# Altium schematic sheet PCB_3U_BNC.schdoc: Title
size 420 x 297 mm; Author: G.K.; CompanyName: WUT; DrawnBy: G.K.; Organization: CERN; Address1: Warsaw Univeristy of Technology; Address2: Nowowiejska 15/19; Revision: -; SheetNumber: -; SheetTotal: -; EDA_Number: ARTIQ; Projet: ADC/DAC MEZZANINE; ModifiedBy: -; CreateDate: XX/XX/XXXX; CheckedDate: -; Title2: Title2; DivGrp: ISE; Designer: G.K.; ModifiedDate: -; ProjectName: ADC/DAC MEZZANINE
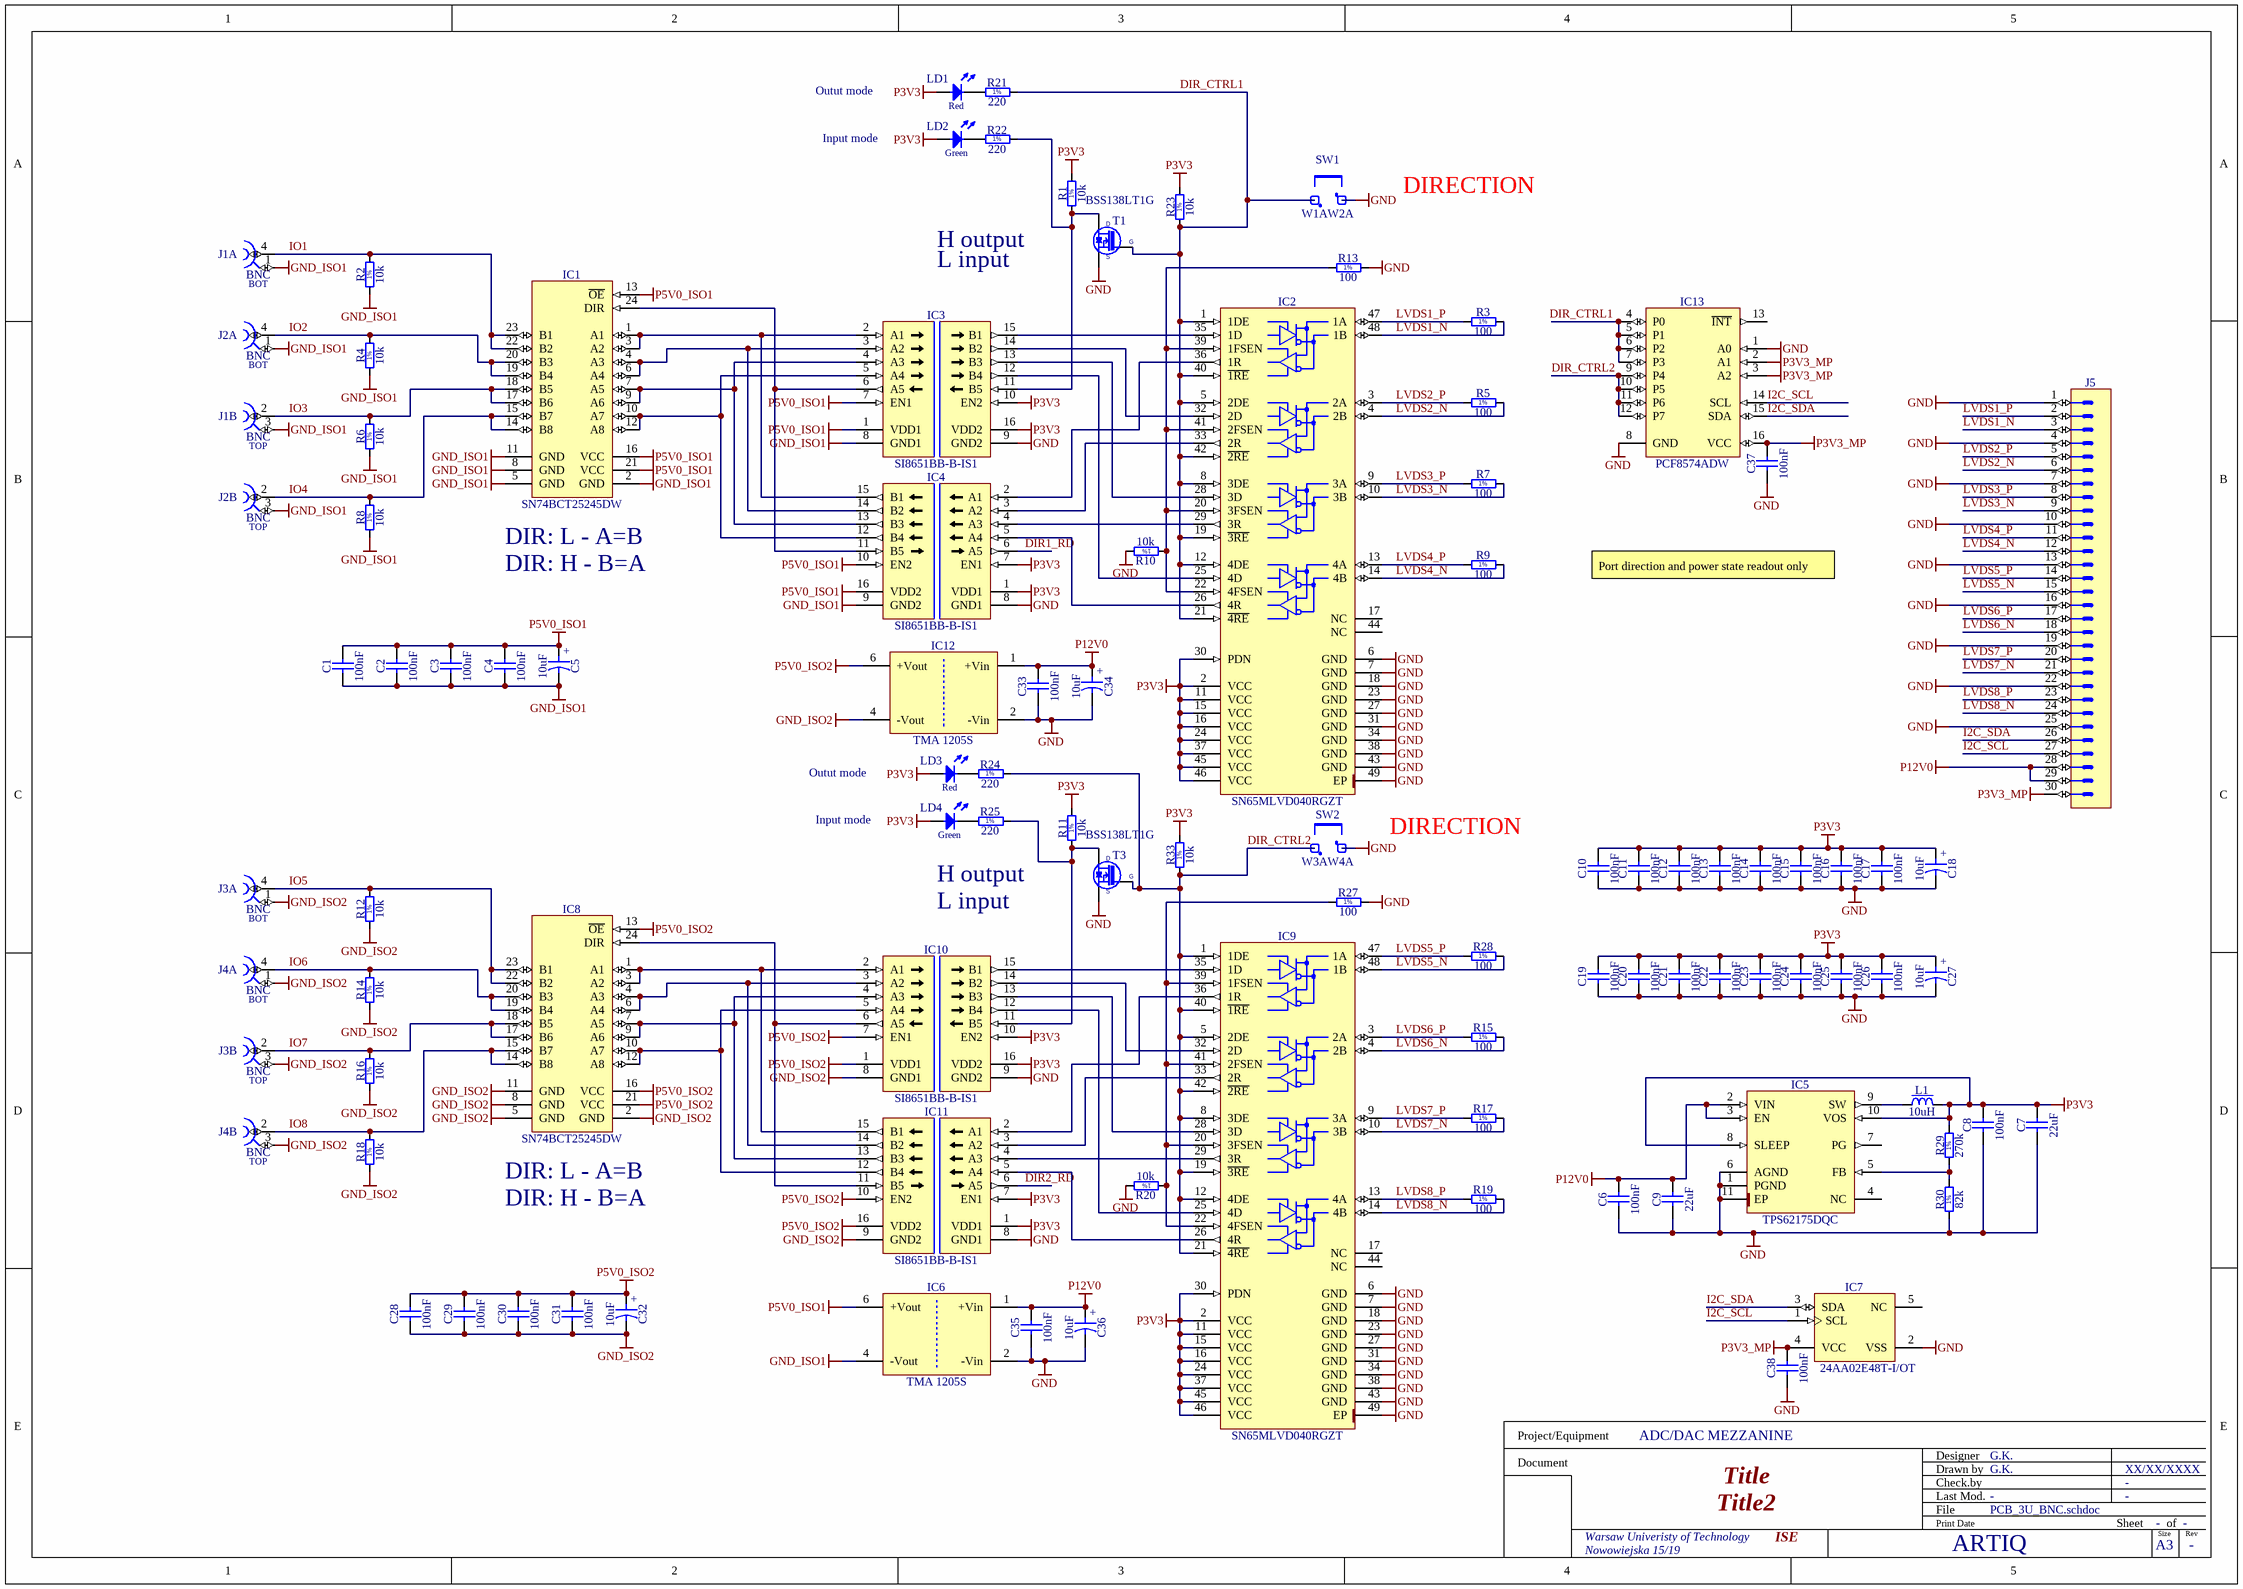
[diagram p0: PCB_3U_BNC.schdoc]

## Parts
C1  100nF  [CAPC1005X55N]
C2  100nF  [CAPC1005X55N]
C3  100nF  [CAPC1005X55N]
C4  100nF  [CAPC1005X55N]
C5  10uF  [CAPAE430X540N]
C6  100nF  [CAPC1005X55N]
C7  22uF  [CAPC2012X135N]
C8  100nF  [CAPC1005X55N]
C9  22uF  [CAPC2012X135N]
C10  100nF  [CAPC1005X55N]
C11  100nF  [CAPC1005X55N]
C12  100nF  [CAPC1005X55N]
C13  100nF  [CAPC1005X55N]
C14  100nF  [CAPC1005X55N]
C15  100nF  [CAPC1005X55N]
C16  100nF  [CAPC1005X55N]
C17  100nF  [CAPC1005X55N]
C18  10uF  [CAPAE430X540N]
C19  100nF  [CAPC1005X55N]
C20  100nF  [CAPC1005X55N]
C21  100nF  [CAPC1005X55N]
C22  100nF  [CAPC1005X55N]
C23  100nF  [CAPC1005X55N]
C24  100nF  [CAPC1005X55N]
C25  100nF  [CAPC1005X55N]
C26  100nF  [CAPC1005X55N]
C27  10uF  [CAPAE430X540N]
C28  100nF  [CAPC1005X55N]
C29  100nF  [CAPC1005X55N]
C30  100nF  [CAPC1005X55N]
C31  100nF  [CAPC1005X55N]
C32  10uF  [CAPAE430X540N]
C33  100nF  [CAPC1005X55N]
C34  10uF  [CAPAE430X540N]
C35  100nF  [CAPC1005X55N]
C36  10uF  [CAPAE430X540N]
C37  100nF  [CAPC1005X55N]
C38  100nF  [CAPC1005X55N]
IC1  SN74BCT25245DW  [SOIC127P1030X265-24N]
IC2  SN65MLVD040RGZT  [QFN50P700X700X100-49N-S420]
IC3  SI8651BB-B-IS1  [SOIC127P600X175-16N]
IC4  SI8651BB-B-IS1  [SOIC127P600X175-16N]
IC5  TPS62175DQC  [SON50P200X300X80-11N-R94X250]
IC6  TMA 1205S  [DCDC_TRACO_TMA]
IC7  24AA02E48T-I/OT  [SOT95P280X145-5N]
IC8  SN74BCT25245DW  [SOIC127P1030X265-24N]
IC9  SN65MLVD040RGZT  [QFN50P700X700X100-49N-S420]
IC10  SI8651BB-B-IS1  [SOIC127P600X175-16N]
IC11  SI8651BB-B-IS1  [SOIC127P600X175-16N]
IC12  TMA 1205S  [DCDC_TRACO_TMA]
IC13  PCF8574ADW  [SOIC127P1030X265-16N]
J1  BNC  [BOMAR_364A2595]  (parts A,B of 2)
J2  BNC  [BOMAR_364A2595]  (parts A,B of 2)
J3  BNC  [BOMAR_364A2595]  (parts A,B of 2)
J4  BNC  [BOMAR_364A2595]  (parts A,B of 2)
J5  (no value)  [3M_N2530-6002RB]
L1  10uH  [IND_MURATA-PS_8400]
LD1  Red  [LED_AVAGO_HSMC-C120]  (value not drawn)
LD2  Green  [LED_AVAGO_HSME-C120]  (value not drawn)
LD3  Red  [LED_AVAGO_HSMC-C120]  (value not drawn)
LD4  Green  [LED_AVAGO_HSME-C120]  (value not drawn)
R1  10k  [RESC1005X40N]
R2  10k  [RESC1005X40N]
R3  100  [RESC1005X40N]
R4  10k  [RESC1005X40N]
R5  100  [RESC1005X40N]
R6  10k  [RESC1005X40N]
R7  100  [RESC1005X40N]
R8  10k  [RESC1005X40N]
R9  100  [RESC1005X40N]
R10  10k  [RESC1005X40N]
R11  10k  [RESC1005X40N]
R12  10k  [RESC1005X40N]
R13  100  [RESC1005X40N]
R14  10k  [RESC1005X40N]
R15  100  [RESC1005X40N]
R16  10k  [RESC1005X40N]
R17  100  [RESC1005X40N]
R18  10k  [RESC1005X40N]
R19  100  [RESC1005X40N]
R20  10k  [RESC1005X40N]
R21  220  [RESC1608X55N]
R22  220  [RESC1608X55N]
R23  10k  [RESC1005X40N]
R24  220  [RESC1608X55N]
R25  220  [RESC1608X55N]
R27  100  [RESC1005X40N]
R28  100  [RESC1005X40N]
R29  270k  [RESC1608X55N]
R30  82k  [RESC1608X55N]
R33  10k  [RESC1005X40N]
SW1  Jumper Type1  [JUMPER_BLACK_INSULATED_2.54MM]  (value not drawn)
SW2  Jumper Type1  [JUMPER_BLACK_INSULATED_2.54MM]  (value not drawn)
T1  BSS138LT1G  [SOT95P240X110-3N]
T3  BSS138LT1G  [SOT95P240X110-3N]
W1  Test Point  [COMATEL_385.0358.1.02.400]  (value not drawn)  (part A of 2)
W2  Test Point  [COMATEL_385.0358.1.02.400]  (value not drawn)  (part A of 2)
W3  Test Point  [COMATEL_385.0358.1.02.400]  (value not drawn)  (part A of 2)
W4  Test Point  [COMATEL_385.0358.1.02.400]  (value not drawn)  (part A of 2)

## Nets
GND: C6.1 C7.1 C8.1 C9.1 C10.1 C11.1 C12.1 C13.1 C14.1 C15.1 C16.1 C17.1 C18.2 C19.1 C20.1 C21.1 C22.1 C23.1 C24.1 C25.1 C26.1 C27.2 C33.1 C34.2 C35.1 C36.2 C37.1 C38.1 IC2.6(GND) IC2.7(GND) IC2.18(GND) IC2.23(GND) IC2.27(GND) IC2.31(GND) IC2.34(GND) IC2.38(GND) IC2.43(GND) IC2.49(EP) IC3.9(GND2) IC4.8(GND1) IC5.1(PGND) IC5.6(AGND) IC5.11(EP) IC6.2(-Vin) IC7.2(VSS) IC9.6(GND) IC9.7(GND) IC9.18(GND) IC9.23(GND) IC9.27(GND) IC9.31(GND) IC9.34(GND) IC9.38(GND) IC9.43(GND) IC9.49(EP) IC10.9(GND2) IC11.8(GND1) IC12.2(-Vin) IC13.1(A0) IC13.8(GND) J5.1 J5.4 J5.7 J5.10 J5.13 J5.16 J5.19 J5.22 J5.25 R10.2 R13.2 R20.2 R27.2 R30.1 T1.2(S) T3.2(S) W2.1 W4.1
GND_ISO1: C1.1 C2.1 C3.1 C4.1 C5.2 IC1.2(GND) IC1.5(GND) IC1.8(GND) IC1.11(GND) IC3.8(GND1) IC4.9(GND2) IC6.4(-Vout) J1.1 J1.3 J2.1 J2.3 R2.1 R4.1 R6.1 R8.1
GND_ISO2: C28.1 C29.1 C30.1 C31.1 C32.2 IC8.2(GND) IC8.5(GND) IC8.8(GND) IC8.11(GND) IC10.8(GND1) IC11.9(GND2) IC12.4(-Vout) J3.1 J3.3 J4.1 J4.3 R12.1 R14.1 R16.1 R18.1
P3V3: C7.2 C8.2 C10.2 C11.2 C12.2 C13.2 C14.2 C15.2 C16.2 C17.2 C18.1 C19.2 C20.2 C21.2 C22.2 C23.2 C24.2 C25.2 C26.2 C27.1 IC2.2(VCC) IC2.11(VCC) IC2.15(VCC) IC2.16(VCC) IC2.24(VCC) IC2.30(PDN) IC2.37(VCC) IC2.45(VCC) IC2.46(VCC) IC3.10(EN2) IC3.16(VDD2) IC4.1(VDD1) IC4.7(EN1) IC5.8(SLEEP) IC5.10(VOS) IC9.2(VCC) IC9.11(VCC) IC9.15(VCC) IC9.16(VCC) IC9.24(VCC) IC9.30(PDN) IC9.37(VCC) IC9.45(VCC) IC9.46(VCC) IC10.10(EN2) IC10.16(VDD2) IC11.1(VDD1) IC11.7(EN1) L1.2 LD1.2(A) LD2.2(A) LD3.2(A) LD4.2(A) R1.2 R11.2 R23.2 R29.2 R33.2
P3V3_MP: C37.2 C38.2 IC7.4(VCC) IC13.2(A1) IC13.3(A2) IC13.16(VCC) J5.30
P5V0_ISO1: C1.2 C2.2 C3.2 C4.2 C5.1 IC1.13(~{OE}) IC1.16(VCC) IC1.21(VCC) IC3.1(VDD1) IC3.7(EN1) IC4.10(EN2) IC4.16(VDD2) IC6.6(+Vout)
P5V0_ISO2: C28.2 C29.2 C30.2 C31.2 C32.1 IC8.13(~{OE}) IC8.16(VCC) IC8.21(VCC) IC10.1(VDD1) IC10.7(EN1) IC11.10(EN2) IC11.16(VDD2) IC12.6(+Vout)
P12V0: C6.2 C9.2 C33.2 C34.1 C35.2 C36.1 IC5.2(VIN) IC5.3(EN) IC6.1(+Vin) IC12.1(+Vin) J5.28 J5.29
DIR1_RD: IC4.6(A5)
DIR2_RD: IC11.6(A5)
DIR_CTRL1: IC2.1(1DE) IC2.5(2DE) IC2.8(3DE) IC2.12(4DE) IC2.19(~{3RE}) IC2.21(~{4RE}) IC2.40(~{1RE}) IC2.42(~{2RE}) R21.2 R23.1 T1.1(G) W1.1
DIR_CTRL2: IC9.1(1DE) IC9.5(2DE) IC9.8(3DE) IC9.12(4DE) IC9.19(~{3RE}) IC9.21(~{4RE}) IC9.40(~{1RE}) IC9.42(~{2RE}) IC13.9(P4) IC13.10(P5) IC13.11(P6) IC13.12(P7) R24.2 R33.1 T3.1(G) W3.1
I2C_SCL: IC7.1(SCL) IC13.14(SCL) J5.27
I2C_SDA: IC7.3(SDA) IC13.15(SDA) J5.26
IO1: IC1.22(B2) IC1.23(B1) J1.4 R2.2
IO2: IC1.19(B4) IC1.20(B3) J2.4 R4.2
IO3: IC1.17(B6) IC1.18(B5) J1.2 R6.2
IO4: IC1.14(B8) IC1.15(B7) J2.2 R8.2
IO5: IC8.22(B2) IC8.23(B1) J3.4 R12.2
IO6: IC8.19(B4) IC8.20(B3) J4.4 R14.2
IO7: IC8.17(B6) IC8.18(B5) J3.2 R16.2
IO8: IC8.14(B8) IC8.15(B7) J4.2 R18.2
LVDS1_N: IC2.48(1B) J5.3 R3.2
LVDS1_P: IC2.47(1A) J5.2 R3.1
LVDS2_N: IC2.4(2B) J5.6 R5.2
LVDS2_P: IC2.3(2A) J5.5 R5.1
LVDS3_N: IC2.10(3B) J5.9 R7.2
LVDS3_P: IC2.9(3A) J5.8 R7.1
LVDS4_N: IC2.14(4B) J5.12 R9.2
LVDS4_P: IC2.13(4A) J5.11 R9.1
LVDS5_N: IC9.48(1B) J5.15 R28.2
LVDS5_P: IC9.47(1A) J5.14 R28.1
LVDS6_N: IC9.4(2B) J5.18 R15.2
LVDS6_P: IC9.3(2A) J5.17 R15.1
LVDS7_N: IC9.10(3B) J5.21 R17.2
LVDS7_P: IC9.9(3A) J5.20 R17.1
LVDS8_N: IC9.14(4B) J5.24 R19.2
LVDS8_P: IC9.13(4A) J5.23 R19.1
NetIC1_1: IC1.1(A1) IC1.3(A2) IC3.2(A1) IC4.15(B1)
NetIC1_4: IC1.4(A3) IC1.6(A4) IC3.3(A2) IC4.14(B2)
NetIC1_7: IC1.7(A5) IC1.9(A6) IC3.4(A3) IC4.13(B3)
NetIC1_10: IC1.10(A7) IC1.12(A8) IC3.5(A4) IC4.12(B4)
NetIC1_24: IC1.24(DIR) IC3.6(A5) IC4.11(B5)
NetIC2_20: IC2.20(3FSEN) IC2.22(4FSEN) IC2.39(1FSEN) IC2.41(2FSEN) R10.1 R13.1
NetIC2_25: IC2.25(4D) IC3.12(B4)
NetIC2_26: IC2.26(4R) IC4.5(A4)
NetIC2_28: IC2.28(3D) IC3.13(B3)
NetIC2_29: IC2.29(3R) IC4.4(A3)
NetIC2_32: IC2.32(2D) IC3.14(B2)
NetIC2_33: IC2.33(2R) IC4.3(A2)
NetIC2_35: IC2.35(1D) IC3.15(B1)
NetIC2_36: IC2.36(1R) IC4.2(A1)
NetIC3_11: IC3.11(B5) R1.1 R22.2 T1.3(D)
NetIC5_5: IC5.5(FB) R29.1 R30.2
NetIC5_9: IC5.9(SW) L1.1
NetIC8_1: IC8.1(A1) IC8.3(A2) IC10.2(A1) IC11.15(B1)
NetIC8_4: IC8.4(A3) IC8.6(A4) IC10.3(A2) IC11.14(B2)
NetIC8_7: IC8.7(A5) IC8.9(A6) IC10.4(A3) IC11.13(B3)
NetIC8_10: IC8.10(A7) IC8.12(A8) IC10.5(A4) IC11.12(B4)
NetIC8_24: IC8.24(DIR) IC10.6(A5) IC11.11(B5)
NetIC9_20: IC9.20(3FSEN) IC9.22(4FSEN) IC9.39(1FSEN) IC9.41(2FSEN) R20.1 R27.1
NetIC9_25: IC9.25(4D) IC10.12(B4)
NetIC9_26: IC9.26(4R) IC11.5(A4)
NetIC9_28: IC9.28(3D) IC10.13(B3)
NetIC9_29: IC9.29(3R) IC11.4(A3)
NetIC9_32: IC9.32(2D) IC10.14(B2)
NetIC9_33: IC9.33(2R) IC11.3(A2)
NetIC9_35: IC9.35(1D) IC10.15(B1)
NetIC9_36: IC9.36(1R) IC11.2(A1)
NetIC10_11: IC10.11(B5) R11.1 R25.2 T3.3(D)
NetIC13_4: IC13.4(P0) IC13.5(P1) IC13.6(P2) IC13.7(P3)
NetLD1_1: LD1.1(C) R21.1
NetLD2_1: LD2.1(C) R22.1
NetLD3_1: LD3.1(C) R24.1
NetLD4_1: LD4.1(C) R25.1

Not connected (* = marked no-connect by the designer): IC2 17(NC) 44(NC); IC5 4(NC) 7(PG); IC7 5(NC); IC9 17(NC) 44(NC); IC13 13(~{INT}); SW1 1; SW2 1

## Notes on the sheet
- Outut mode
- Input mode
- H output
- DIRECTION
- L input
- (near IC1) DIR: L - A=B
- DIR: H - B=A
- Port direction and power state readout only
- (near IC8) DIR: L - A=B
- Labels drawn without touching a wire or pin: DIR_CTRL1
- Project/Equipment
- Document
- Designer
- Drawn by
- Check.by
- File
- Last Mod.
- Print Date
- Sheet
- Size
- A3
- of
- Rev
- (in symbol BOMAR_364A2595, part A) BOT
- (in symbol BOMAR_364A2595, part B) TOP
- (in symbol CAE430-540_10UF_16V_20%) +
- (in symbol R0402_10K_1%_0.0625W_100PPM) 1%
- (in symbol R0402_100R_1%_0.1W_100PPM) 1%
- (in symbol R0603_82K_1%_0.1W_100PPM) 1%
- (in symbol R0603_220R_1%_0.1W_100PPM) 1%
- (in symbol R0603_270K_1%_0.1W_100PPM) 1%

## Library data of the parts
C1-C4 C6 C8 C10-C17 C19-C26 C28-C31 C33 C35 C37 C38 = CC0402_100NF_16V_10%_X5R: Non-polarised capacitor; Part Description: SMD Multilayer Chip Ceramic Capacitor; Manufacturer: GENERIC; Manufacturer1 Part Number: GRM155R61C104KA88D; Voltage: 16V; TC: X5R; Tolerance: ±10%; Part Number: CC0402_100NF_16V_10%_X5R; Component Kind: Standard; Component Type: Standard; Pin Count: 2; Value: 100nF; Status: None; Manufacturer Part Number: CC0402_100NF_16V_10%_X5R; Case: 0402; Mounted: Yes; Socket: No; SMD: Yes; Sense: No; Manufacturer1 Example: MURATA; Manufacturer1 ComponentHeight: 0.55mm; HelpURL: \\cern.ch\dfs\Applications\Altium\Datasheets\CC0402_X5R_MURATA_GRM.pdf; Author: CERN DEM JLC; CreateDate: 10.12.2013; LatestRevisionDate: 10.12.2013
C5 C18 C27 C32 C34 C36 = CAE430-540_10UF_16V_20%: Polarised capacitor; Part Description: Aluminum Electrolytic SMT Capacitor; Manufacturer: PANASONIC; Manufacturer Part Number: EEEFK1C100AR; Voltage: 16V; Tolerance: ±20%; Part Number: CAE430-540_10UF_16V_20%; Component Kind: Standard; Component Type: Standard; Pin Count: 2; Value: 10uF; Status: Not Recommended; Case: B; Mounted: Yes; Socket: No; SMD: Yes; Sense: No; ComponentHeight: 5.8mm; HelpURL: \\cern.ch\dfs\Applications\Altium\Datasheets\CAE_PANASONIC_FK.pdf; Author: CERN DEM JLC; CreateDate: 03.12.2007; LatestRevisionDate: 05.11.2014
C7 C9 = CC0805_22UF_16V_10%_X5R: Non-polarised capacitor; Part Description: SMD Multilayer Chip Ceramic Capacitor; Manufacturer: GENERIC; Manufacturer1 Part Number: C2012X5R1C226KT; Voltage: 16V; TC: X5R; Tolerance: ±10%; Part Number: CC0805_22UF_16V_10%_X5R; Component Kind: Standard; Component Type: Standard; Pin Count: 2; Value: 22uF; Status: Preferred; Manufacturer Part Number: CC0805_22UF_16V_10%_X5R; Case: 0805; Mounted: Yes; Socket: No; SMD: Yes; Sense: No; Manufacturer1 Example: TDK; Manufacturer1 ComponentHeight: 1.35mm; HelpURL: \\cern.ch\dfs\Applications\Altium\Datasheets\CC0805_X5R_TDK_C.pdf; Author: CERN DEM JLC; CreateDate: 25.10.2012; LatestRevisionDate: 25.10.2012
IC1 IC8 = SN74BCT25245DW: 25 Ohms Octal Bus Transceiver With 3-State Outputs; Manufacturer: TEXAS INSTRUMENTS; PressFit: No; Bonding: No; Part Number: SN74BCT25245DW; Component Kind: Standard; Component Type: Standard; Device: SN74BCT25245DW; PackageDescription: SOIC 24, Pitch 1.27mm - Body 7.6x15.6mm, IPC Medium Density; Part Description: 25 Ohms Octal Bus Transceiver With 3-State Outputs; Manufacturer Part Number: SN74BCT25245DW; Pin Count: 24; Case: SOIC24; Mounted: Yes; Socket: No; SMD: Yes; Sense: No; ComponentHeight: 2.65mm; Author: CERN DEM JLC; HelpURL: \\cern.ch\dfs\Applications\Altium\Datasheets\SN74BCT25245DW.pdf; CreateDate: 09.11.2009; LatestRevisionDate: 09.11.2009
IC2 IC9 = SN65MLVD040RGZT: 4-Channel Half-Duplex M-LVDS Line Transceiver; Manufacturer: TEXAS INSTRUMENTS; PressFit: No; Bonding: No; Part Number: SN65MLVD040RGZT; Component Kind: Standard; Component Type: Standard; Device: SN65MLVD040RGZT; PackageDescription: QFN, 0.50mm Pitch, Square; 48 Pin, 7.00mm L X 7.00mm W X 1mm H body (W/Thermal Tab 4.2mm X 4.2mm), IPC Medium Density; Part Description: 4-Channel Half-Duplex M-LVDS Line Transceiver; Manufacturer Part Number: SN65MLVD040RGZT; Pin Count: 49; Case: QFN48; Mounted: Yes; Socket: No; SMD: Yes; Sense: No; ComponentHeight: 1mm; Author: CERN DEM JLC; HelpURL: \\cern.ch\dfs\Applications\Altium\Datasheets\SN65MLVD040RGZT.pdf; CreateDate: 17.03.2011; LatestRevisionDate: 17.03.2011
IC3 IC4 IC10 IC11 = SI8651BB-B-IS1: Low Power Five-Channel Digital Isolator; Part Description: 2.5kV 150Mbps Low Power Five-Channel Digital Isolator; Manufacturer: SILICON LABS; PressFit: No; Bonding: No; Part Number: SI8651BB-B-IS1; Component Kind: Standard; Component Type: Standard; Device: SI8651BB-B-IS1; PackageDescription: SOIC 16, Pitch 1.27mm - Body 4x10mm, IPC Medium Density; Manufacturer Part Number: SI8651BB-B-IS1; Pin Count: 16; Case: SOIC16; Mounted: Yes; Socket: No; SMD: Yes; Sense: No; ComponentHeight: 1.75mm; Author: CERN DEM JLC; HelpURL: \\cern.ch\dfs\Applications\Altium\Datasheets\SI8651BB-B-IS1.pdf; CreateDate: 31.10.2013; LatestRevisionDate: 31.10.2013
IC5 = TPS62175DQC: 4.75-28VDC to 1-6VDC, 500mA Step-Down Converter With Sleep Mode; Manufacturer: TEXAS INSTRUMENTS; PressFit: No; Bonding: No; Part Number: TPS62175DQC; Component Kind: Standard; Component Type: Standard; Device: TPS62175DQC; PackageDescription: SON, 10-Leads, Body 2x3mm, Pitch 0.5mm, Thermal Pad 0.94x2.5mm, IPC Medium Density; Part Description: 4.75-28VDC to 1-6VDC, 500mA Step-Down Converter With Sleep Mode; Manufacturer Part Number: TPS62175DQC; Pin Count: 11; Case: SON10; Mounted: Yes; Socket: No; SMD: Yes; Sense: No; ComponentHeight: 0.8mm; HelpURL: \\cern.ch\dfs\Applications\Altium\Datasheets\TPS62175DQC.pdf; Author: CERN DEM JMW; CreateDate: 11.08.2015; LatestRevisionDate: 11.08.2015
IC6 IC12 = DC/DC_TRACO_TMA1205S: 1 W Watt, 10.8-13.2VDCVin, 5 V@0.2 A; Part Description: 12V ±10% to 5V, Iout (max) 200mA, 1W DC-DC Converter; Manufacturer: TRACO POWER; PressFit: No; Bonding: No; Part Number: TMA 1205S; Component Kind: Standard; Component Type: Standard; Device: TMA 1205S; PackageDescription: TMA Series, Body 19.5x6.1mm, SIP-6, Unregulated; Manufacturer Part Number: TMA 1205S; Pin Count: 4; Mounted: Yes; Socket: No; SMD: No; Sense: No; ComponentHeight: 10.45mm; HelpURL: \\cern.ch\dfs\Applications\Altium\Datasheets\TMA 0505S.pdf; Author: GK; CreateDate: 17.12.2016; LatestRevisionDate: 17.12.2016
IC7 = 24AA02E48T-I/OT: 1.7V-5.5V, 2K I2C Serial EEPROM With EUI-48 Node Identity; Manufacturer: MICROCHIP TECHNOLOGY; PressFit: No; Bonding: No; Part Number: 24AA02E48T-I/OT; Component Kind: Standard; Component Type: Standard; Device: 24AA02E48T-I/OT; PackageDescription: SOT, 0.95mm pitch; 5 pin, 1.60mm W X 2.90mm L X 1.45mm H body, IPC Medium Density; Part Description: 1.7V-5.5V, 2K I2C Serial EEPROM With EUI-48 Node Identity; Manufacturer Part Number: 24AA02E48T-I/OT; Pin Count: 5; Case: SOT23-5; Mounted: Yes; Socket: No; SMD: Yes; Sense: No; ComponentHeight: 1.45mm; HelpURL: \\cern.ch\dfs\Applications\Altium\Datasheets\24AA02E48T-I-OT.pdf; Author: CERN DEM MR; CreateDate: 31.03.2016; LatestRevisionDate: 31.03.2016
IC13 = PCF8574ADW: Remote 8-bit I/O Expander For I2C Bus; Manufacturer: TEXAS INSTRUMENTS; PressFit: No; Bonding: No; Part Number: PCF8574ADW; Component Kind: Standard; Component Type: Standard; Device: PCF8574ADW; PackageDescription: SOIC 16, Pitch 1.27mm - Body 7.5x10.3mm, IPC Medium Density; Part Description: Remote 8-bit I/O Expander For I2C Bus; Manufacturer Part Number: PCF8574ADW; Pin Count: 16; Case: SOIC16W; Mounted: Yes; Socket: No; SMD: Yes; Sense: No; ComponentHeight: 2.65mm; Author: CERN DEM JLC; HelpURL: \\cern.ch\dfs\Applications\Altium\Datasheets\PCF8574ADW.pdf; CreateDate: 01.11.2012; LatestRevisionDate: 01.11.2012
J1-J4 = BOMAR_364A2595: Dual Right Angle 50 Ohm BNC Jack, White Valox Case; Manufacturer: BOMAR INTERCONNECT; PressFit: No; Part Number: BOMAR_364A2595; Component Kind: Standard; Component Type: Standard; Pin Count: 6; Family: BNC; Mounted: Yes; Socket: No; SMD: No; Sense: No; Status: None; Part Description: Dual Right Angle 50 Ohm BNC Jack, White Valox Case; Manufacturer Part Number: 364A2595; ComponentHeight: 29.3mm; HelpURL: \\cern.ch\dfs\Applications\Altium\Datasheets\BOMAR_364A2595.pdf; Author: CERN DEM JLC; CreateDate: 09.04.2013; LatestRevisionDate: 09.04.2013
J5 = 3M_N2530-6002RB: Connector 30 Male; Part Description: 30 Contacts - Straight .100'' x .100'' Low Profile Four-Wall Header, 2500 Series; Manufacturer: 3M; PressFit: No; Part Number: 3M_N2530-6002RB; Component Kind: Standard; Component Type: Standard; Pin Count: 30; Family: Header 30; Mounted: Yes; Socket: No; SMD: No; Sense: No; Status: None; Manufacturer Part Number: N2530-6002RB; ComponentHeight: 10.03mm; HelpURL: \\cern.ch\dfs\Applications\Altium\Datasheets\3M_N2530-6002RB.pdf; Author: CERN DEM JLC; CreateDate: 11.02.2009; LatestRevisionDate: 11.08.2009
L1 = IND_10UH_10%_MURATA-PS_8400: Inductor With Core; Part Description: Miniature Surface Mount Power Inductor (8400 Serie); Manufacturer: MURATA POWER SOLUTIONS; Manufacturer Part Number: 84103C; Power: 950mA; Resistance: 0.24R; Tolerance: ±10%; Part Number: IND_10UH_10%_MURATA-PS_8400; Component Kind: Standard; Component Type: Standard; Pin Count: 2; Value: 10uH; Status: None; Mounted: Yes; Socket: No; SMD: Yes; Sense: No; ComponentHeight: 2.9mm; HelpURL: \\cern.ch\dfs\Applications\Altium\Datasheets\IND_MURATA-PS_8400.pdf; Author: CERN DEM JLC; CreateDate: 02.07.2012; LatestRevisionDate: 02.07.2012
LD1 LD3 = LED_AVAGO_HSMC-C120: LED Red 1C 2A; Part Description: High Performance Right Angle Chip Red LED; Manufacturer: AVAGO TECHNOLOGIES; PressFit: No; Bonding: No; Part Number: LED_AVAGO_HSMC-C120; Component Kind: Standard; Component Type: Standard; Color: Red; PackageDescription: Red Chip LED, 2-Leads, Body 1.7x1.1mm, Side Emitting Package; Manufacturer Part Number: HSMC-C120; Pin Count: 2; Mounted: Yes; Socket: No; SMD: Yes; Sense: No; ComponentHeight: 0.7mm; HelpURL: \\cern.ch\dfs\Applications\Altium\Datasheets\LED_AVAGO_HSMC-C120.pdf; ComponentLink1URL: \\cern.ch\dfs\Applications\Altium\Datasheets\LED_AVAGO_HSMC-C120_DESIGN-GUIDE.pdf; ComponentLink1Description: Design Guide; Author: CERN DEM JMW; CreateDate: 22.07.2009; LatestRevisionDate: 20.06.2012
LD2 LD4 = LED_AVAGO_HSME-C120: LED Green 1C 2A; Part Description: High Performance Right Angle Chip Green LED; Manufacturer: AVAGO TECHNOLOGIES; PressFit: No; Bonding: No; Part Number: LED_AVAGO_HSME-C120; Component Kind: Standard; Component Type: Standard; Color: Green; PackageDescription: Green Chip LED, 2-Leads, Body 1.7x1.1mm, Side Emitting Package; Manufacturer Part Number: HSME-C120; Pin Count: 2; Mounted: Yes; Socket: No; SMD: Yes; Sense: No; ComponentHeight: 0.7mm; HelpURL: \\cern.ch\dfs\Applications\Altium\Datasheets\LED_AVAGO_HSME-C120.pdf; ComponentLink1URL: \\cern.ch\dfs\Applications\Altium\Datasheets\LED_AVAGO_HSME-C110_DESIGN-GUIDE.pdf; ComponentLink1Description: Design Guide; Author: CERN DEM JMW; CreateDate: 22.07.2009; LatestRevisionDate: 20.06.2012
R1 R2 R4 R6 R8 R10-R12 R14 R16 R18 R20 R23 R33 = R0402_10K_1%_0.0625W_100PPM: Resistor - 1%; Part Description: General Purpose Thick Film Chip Resistor; Manufacturer: GENERIC; Manufacturer1 Part Number: 232270671003L; TC: ±100ppm/°C; Part Number: R0402_10K_1%_0.0625W_100PPM; Component Kind: Standard; Component Type: Standard; Pin Count: 2; Value: 10k; Status: Not recommended; Power: 0.0625W; Tolerance: ±1%; Manufacturer Part Number: R0402_10K_1%_0.0625W_100PPM; Case: 0402; Mounted: Yes; Sense: No; Socket: No; SMD: Yes; Manufacturer1 Example: YAGEO PHYCOMP; Manufacturer1 ComponentHeight: 0.4mm; HelpURL: \\cern.ch\dfs\Applications\Altium\Datasheets\R0402_Phycomp_RC0402.pdf; Author: CERN DEM JLC; CreateDate: 03.12.2007; LatestRevisionDate: 17.10.2012
R3 R5 R7 R9 R13 R15 R17 R19 R27 R28 = R0402_100R_1%_0.1W_100PPM: Resistor - 1%; Part Description: General Purpose Thick Film Chip Resistor; Manufacturer: GENERIC; Manufacturer Part Number: R0402_100R_1%_0.1W_100PPM_50V; Manufacturer1 Part Number: ERJ2RKF1000X; Power: 0.1W; TC: ±100ppm/°C; Voltage: 50V; Part Number: R0402_100R_1%_0.1W_100PPM; Component Kind: Standard; Component Type: Standard; Pin Count: 2; Value: 100; Status: Not recommended; Tolerance: ±1%; Case: 0402; Mounted: Yes; Sense: No; Socket: No; SMD: Yes; Manufacturer1 Example: PANASONIC; Manufacturer1 ComponentHeight: 0.4mm; HelpURL: \\cern.ch\dfs\Applications\Altium\Datasheets\R0402_PANASONIC_ERJ2RK.pdf; Author: CERN DEM JLC; CreateDate: 12.12.2013; LatestRevisionDate: 03.03.2015
R21 R22 R24 R25 = R0603_220R_1%_0.1W_100PPM: Resistor - 1%; Part Description: General Purpose Thick Film Chip Resistor; Manufacturer: GENERIC; Manufacturer1 Part Number: NRC06F2200TRF; Power: 0.1W; TC: ±100ppm/°C; Part Number: R0603_220R_1%_0.1W_100PPM; Component Kind: Standard; Component Type: Standard; Pin Count: 2; Value: 220; Status: Preferred; Tolerance: ±1%; Manufacturer Part Number: R0603_220R_1%_0.1W_100PPM; Case: 0603; Mounted: Yes; Sense: No; Socket: No; SMD: Yes; Manufacturer1 Example: NIC COMPONENT; Manufacturer1 ComponentHeight: 0.55mm; HelpURL: \\cern.ch\dfs\Applications\Altium\Datasheets\R0603_NIC_NRC.pdf; Author: CERN DEM JLC; CreateDate: 03.12.2007; LatestRevisionDate: 13.03.2008
R29 = R0603_270K_1%_0.1W_100PPM: Resistor - 1%; Part Description: General Purpose Thick Film Chip Resistor; Manufacturer: GENERIC; Manufacturer1 Part Number: NRC06F2703TRF; Power: 0.1W; TC: ±100ppm/°C; Part Number: R0603_270K_1%_0.1W_100PPM; Component Kind: Standard; Component Type: Standard; Pin Count: 2; Value: 270k; Status: Preferred; Tolerance: ±1%; Manufacturer Part Number: R0603_270K_1%_0.1W_100PPM; Case: 0603; Mounted: Yes; Sense: No; Socket: No; SMD: Yes; Manufacturer1 Example: NIC COMPONENT; Manufacturer1 ComponentHeight: 0.55mm; HelpURL: \\cern.ch\dfs\Applications\Altium\Datasheets\R0603_NIC_NRC.pdf; Author: CERN DEM JLC; CreateDate: 03.12.2007; LatestRevisionDate: 13.03.2008
R30 = R0603_82K_1%_0.1W_100PPM: Resistor - 1%; Part Description: General Purpose Thick Film Chip Resistor; Manufacturer: GENERIC; Manufacturer1 Part Number: NRC06F8202TRF; Power: 0.1W; TC: ±100ppm/°C; Part Number: R0603_82K_1%_0.1W_100PPM; Component Kind: Standard; Component Type: Standard; Pin Count: 2; Value: 82k; Status: Preferred; Tolerance: ±1%; Manufacturer Part Number: R0603_82K_1%_0.1W_100PPM; Case: 0603; Mounted: Yes; Sense: No; Socket: No; SMD: Yes; Manufacturer1 Example: NIC COMPONENT; Manufacturer1 ComponentHeight: 0.55mm; HelpURL: \\cern.ch\dfs\Applications\Altium\Datasheets\R0603_NIC_NRC.pdf; Author: CERN DEM JLC; CreateDate: 03.12.2007; LatestRevisionDate: 13.03.2008
SW1 SW2 = COMATEL_313.1730.0.00.40.0: Jumper 1 Pin; Part Description: Closed Insulated Black Jumper Pitch 2.54mm; Manufacturer: KONTEK COMATEL; PressFit: No; SCEM: 09.55.10.960.9; Part Number: COMATEL_313.1730.0.00.40.0; Component Kind: Standard; Component Type: Standard; Pin Count: 1; Family: Jumper; Mounted: Yes; Socket: No; SMD: No; Sense: No; Status: Obsolete; Manufacturer Part Number: 313.1730.0.00.40.0; ComponentHeight: 6.5mm; HelpURL: \\cern.ch\dfs\Applications\Altium\Datasheets\COMATEL_313.1730.0.00.40.0.pdf; Author: CERN DEM JLC; CreateDate: 09.04.2008; LatestRevisionDate: 27.08.2013
T1 T3 = BSS138LT1G: N-CHANNEL MOSFET WITH DIODE; Part Description: 50V 200mA N-Channel Enhancement Mode Field-Effect Transistor; Manufacturer: ON SEMICONDUCTOR; PressFit: No; Bonding: No; Part Number: BSS138LT1G; Component Kind: Standard; Component Type: Standard; Device: BSS138LT1G; PackageDescription: SOT23 3-Leads, Pitch 0.95mm - Body 1.4x3mm, IPC Medium Density; Manufacturer Part Number: BSS138LT1G; Pin Count: 3; Case: SOT23-3; Mounted: Yes; Socket: No; SMD: Yes; Sense: No; ComponentHeight: 1.11mm; HelpURL: \\cern.ch\dfs\Applications\Altium\Datasheets\BSS138LT1G.pdf; Author: CERN DEM JLC; CreateDate: 23.03.2009; LatestRevisionDate: 23.03.2009
W1-W4 = COMATEL_385.0358.1.02.400: 2 Mini Wire-Wrap Contact Strip Header; Part Description: 2 Contacts Straight Strip Header Pitch 2.54mm L=6.3mm ''Mini-Wire-Wrap''; Manufacturer: KONTEK COMATEL; PressFit: No; Part Number: COMATEL_385.0358.1.02.400; Component Kind: Standard; Component Type: Standard; Pin Count: 2; Family: Test Point; Mounted: Yes; Socket: No; SMD: No; Sense: No; Status: Not recommended; Manufacturer Part Number: 385.0358.1.02.400; ComponentHeight: 8mm; HelpURL: \\cern.ch\dfs\Applications\Altium\Datasheets\COMATEL_385.0358.1.02.400.pdf; Author: CERN DEM JLC; CreateDate: 30.06.2010; LatestRevisionDate: 10.10.2012